# EAGLE design untitled (EAGLE 7.5.0)
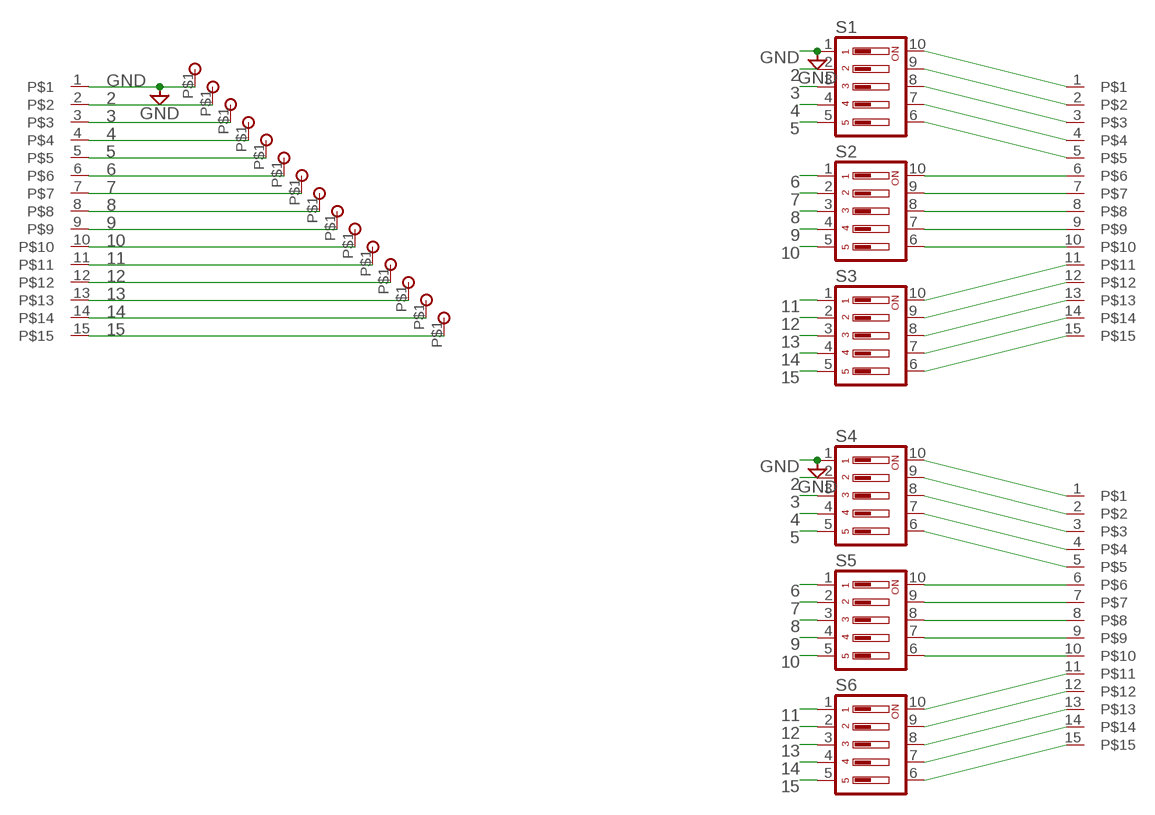
[diagram p0: schematic, sheet 1]

## Parts
C1  FMZ15  [FMZ15]
C2  FMZ15  [FMZ15]
RAS  FMZ15  [FMZ15]
S1  DIP05YL  [DIP05YL]
S2  DIP05YL  [DIP05YL]
S3  DIP05YL  [DIP05YL]
S4  DIP05YL  [DIP05YL]
S5  DIP05YL  [DIP05YL]
S6  DIP05YL  [DIP05YL]
U$4  CHECK_0.8MM  [CHECK_0.8MM]
U$5  CHECK_0.8MM  [CHECK_0.8MM]
U$6  CHECK_0.8MM  [CHECK_0.8MM]
U$7  CHECK_0.8MM  [CHECK_0.8MM]
U$8  CHECK_0.8MM  [CHECK_0.8MM]
U$9  CHECK_0.8MM  [CHECK_0.8MM]
U$10  CHECK_0.8MM  [CHECK_0.8MM]
U$11  CHECK_0.8MM  [CHECK_0.8MM]
U$12  CHECK_0.8MM  [CHECK_0.8MM]
U$13  CHECK_0.8MM  [CHECK_0.8MM]
U$14  CHECK_0.8MM  [CHECK_0.8MM]
U$15  CHECK_0.8MM  [CHECK_0.8MM]
U$16  CHECK_0.8MM  [CHECK_0.8MM]
U$17  CHECK_0.8MM  [CHECK_0.8MM]
U$18  CHECK_0.8MM  [CHECK_0.8MM]

## Nets
2: RAS.2 S1.2 S4.2 U$5.P$1
3: RAS.3 S1.3 S4.3 U$6.P$1
4: RAS.4 S1.4 S4.4 U$7.P$1
5: RAS.5 S1.5 S4.5 U$8.P$1
6: RAS.6 S2.1 S5.1 U$9.P$1
7: RAS.7 S2.2 S5.2 U$10.P$1
8: RAS.8 S2.3 S5.3 U$11.P$1
9: RAS.9 S2.4 S5.4 U$12.P$1
10: RAS.10 S2.5 S5.5 U$13.P$1
11: RAS.11 S3.1 S6.1 U$14.P$1
12: RAS.12 S3.2 S6.2 U$15.P$1
13: RAS.13 S3.3 S6.3 U$16.P$1
14: RAS.14 S3.4 S6.4 U$17.P$1
15: RAS.15 S3.5 S6.5 U$18.P$1
GND: RAS.1 S1.1 S4.1 U$4.P$1
N$6: C1.1 S1.10
N$7: C1.2 S1.9
N$8: C1.3 S1.8
N$9: C1.4 S1.7
N$10: C1.5 S1.6
N$16: C1.10 S2.6
N$17: C1.9 S2.7
N$18: C1.8 S2.8
N$19: C1.7 S2.9
N$20: C1.6 S2.10
N$26: C1.15 S3.6
N$27: C1.14 S3.7
N$28: C1.13 S3.8
N$29: C1.12 S3.9
N$30: C1.11 S3.10
N$31: C2.5 S4.6
N$32: C2.4 S4.7
N$33: C2.3 S4.8
N$34: C2.2 S4.9
N$35: C2.1 S4.10
N$36: C2.10 S5.6
N$37: C2.9 S5.7
N$38: C2.8 S5.8
N$39: C2.7 S5.9
N$40: C2.6 S5.10
N$41: C2.15 S6.6
N$42: C2.14 S6.7
N$43: C2.13 S6.8
N$44: C2.12 S6.9
N$45: C2.11 S6.10

## Library data of the parts
C1 C2 RAS = 08_CONECTOR:FMZ15
S1-S6 = 09_1_switch:DIP05YL: DIL/CODE SWITCH; OC_FARNELL: unknown; OC_NEWARK: unknown
U$4-U$18 = 08_CONECTOR:CHECK_0.8MM

## Board
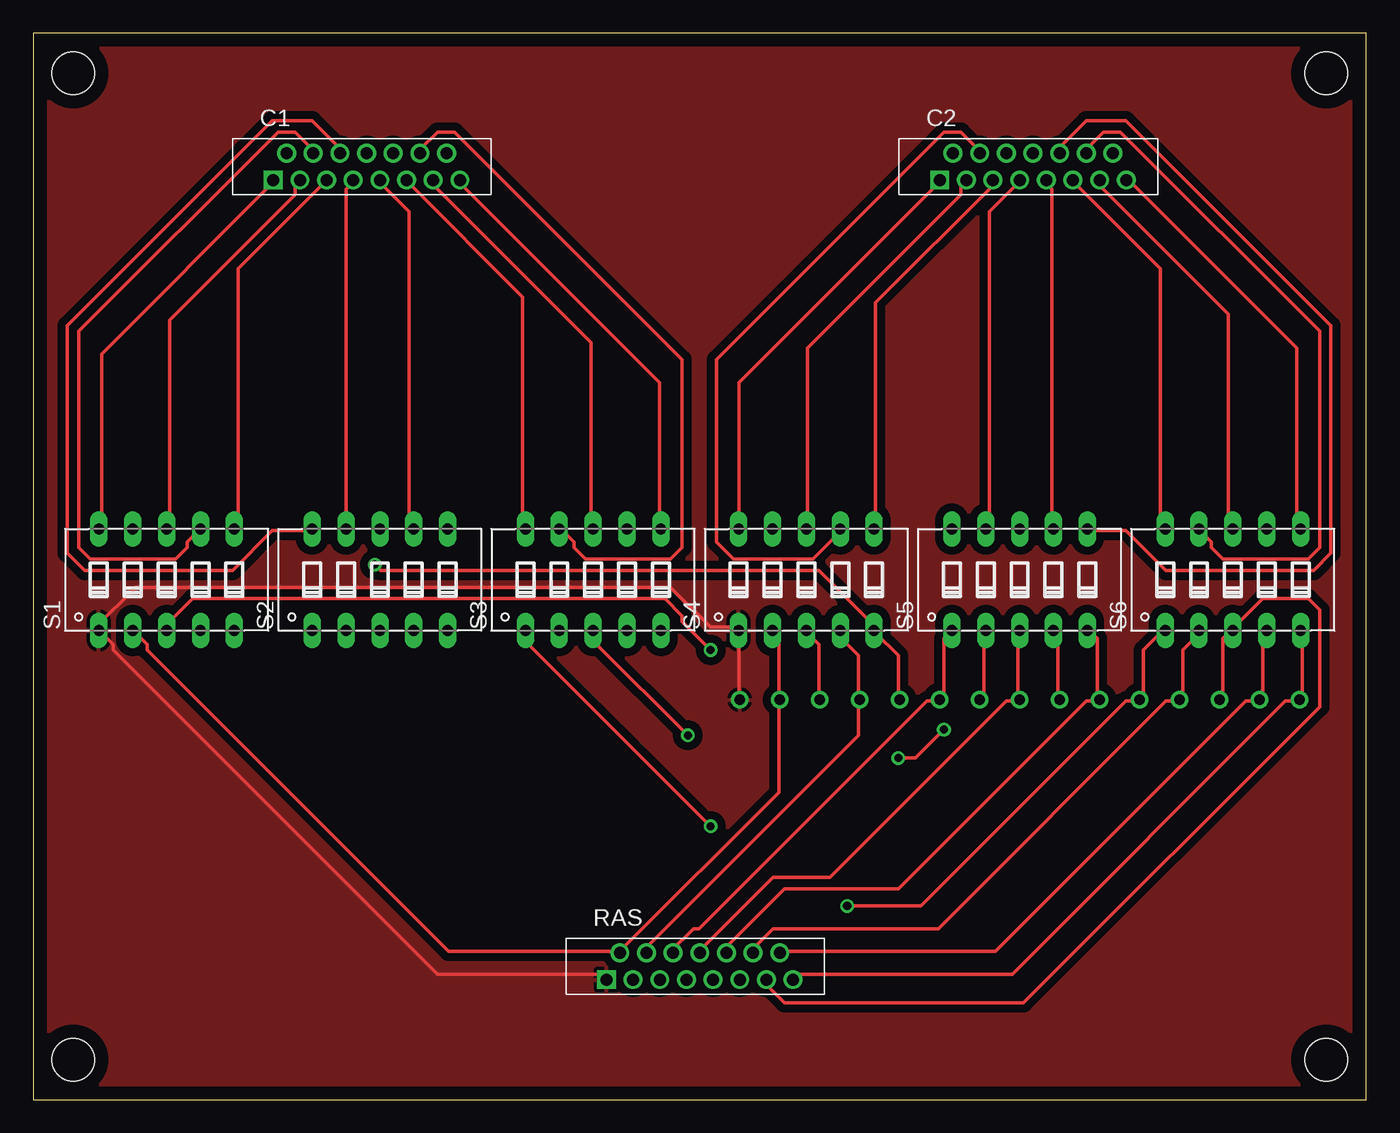
[diagram p1: board, top side]
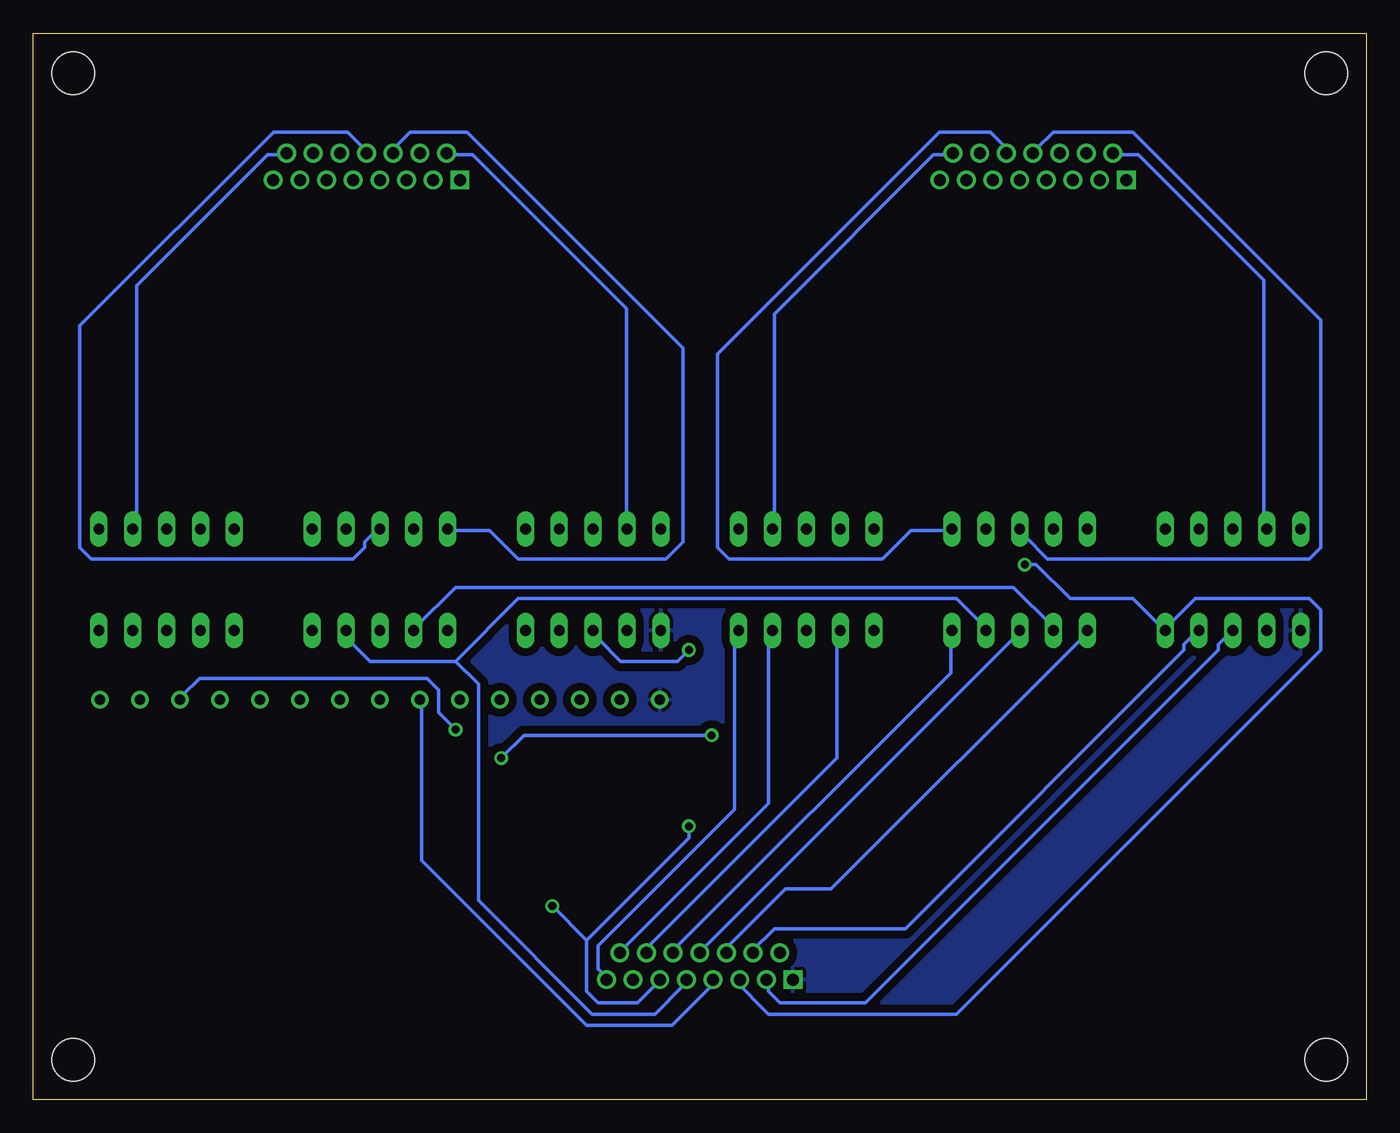
[diagram p2: board, bottom side, seen from below]

Size 100 x 80 mm. Coordinates in mm from the lower left corner, seen from the top.
Outline: 0,0 100,0 100,80 0,80 0,0
Copper layers (1*16): Top 0.035mm / dielectric 1.5mm / Bottom 0.035mm
Design rules "default *": minimum track width 10mil, minimum drill 24mil, track to track 0.6mm, track to pad 0.6mm, pad to pad 0.6mm, via to via 0.015240625mm, smd to smd 0.6mm, copper to edge 40mil, drill to drill 8mil, minimum pad ring 10mil, minimum via ring 8mil, stop-mask expansion 4mil, vias tented up to drill 0mil, thermal gap 10mil
Holes 3.2 mm at 3,77 97,77 97,3 3,3

### Footprints (pad centres in the part's own frame; a part is rotated, then mirrored left to right if it is on the bottom)
FMZ15 = drill 0.9 square: 1 -7,-1 | drill 0.9: 2 -6,1; 3 -5,-1; 4 -4,1; 5 -3,-1; 6 -2,1; 7 -1,-1; 8 0,1; 9 1,-1; 10 2,1; 11 3,-1; 12 4,1; 13 5,-1; 14 6,1; 15 7,-1
DIP05YL = drill 0.813 long: 1 -5.08,-3.81; 2 -2.54,-3.81; 3 0,-3.81; 4 2.54,-3.81; 5 5.08,-3.81; 6 5.08,3.81; 7 2.54,3.81; 8 0,3.81; 9 -2.54,3.81; 10 -5.08,3.81
CHECK_0.8MM = drill 0.8: P$1 0,0

### Placement (x,y rotation side)
C1  25,70 0 top
C2  75,70 0 top
RAS  50,10 0 top
S1  10,39 0 top
S2  26,39 0 top
S3  42,39 0 top
S4  58,39 0 top
S5  74,39 0 top
S6  90,39 0 top
U$4  53,30 90 top
U$5  56,30 90 top
U$6  59,30 90 top
U$7  62,30 90 top
U$8  65,30 90 top
U$9  68,30 90 top
U$10  71,30 90 top
U$11  74,30 90 top
U$12  77,30 90 top
U$13  80,30 90 top
U$14  83,30 90 top
U$15  86,30 90 top
U$16  89,30 90 top
U$17  92,30 90 top
U$18  95,30 90 top

### Tracks (layer width: path | path; a pad name or v marks a point on that pad's centre or on a via)
2
  Top 0.254: S4.2 55.51,35.01 55.94,34.59 55.94,30.32 U$5.P$1 55.94,29.89 55.94,23.06 43.98,11.1 | 43.98,11.1 31.17,11.1 8.54,33.73 8.54,34.16 7.69,35.01 S1.2 | 43.98,11.1 RAS.2
3  (via drill 0.61)
  Top 0.254: U$6.P$1 58.93,30.32 58.93,34.16 58.07,35.01 S4.3 | v50.81,33.73 48.68,35.87 48.68,36.3 47.4,37.58 11.96,37.58 9.82,35.44 S1.3
  Bottom 0.254: S1.3 10.25,35.01 11.1,34.16 11.1,33.73 37.58,7.26 43.98,7.26 44.84,8.11 44.84,8.97 RAS.3 | v50.81,33.73 51.67,32.88 55.94,32.88 57.65,34.59 57.65,35.01 S4.3
4
  Top 0.254: S4.4 60.21,35.01 61.91,33.31 61.91,30.32 U$7.P$1 61.91,29.89 61.91,27.33 45.69,11.1 RAS.4
  Bottom 0.254: S1.4 12.81,35.01 13.66,34.16 13.66,33.73 34.59,12.81 44.41,12.81 46.12,11.1 RAS.4
5  (via drill 0.61)
  Top 0.254: U$8.P$1 64.9,30.32 64.9,33.31 63.2,35.01 S4.5 62.77,35.44 62.77,35.87 58.93,39.71 26.05,39.71 v25.62,40.14
  Bottom 0.254: RAS.5 47.4,8.97 44.84,6.41 30.74,6.41 3.42,33.73 3.42,36.72 4.27,37.58 12.81,37.58 14.95,35.44 S1.5 15.37,35.44 17.51,37.58 22.2,37.58 24.77,40.14 v25.62,40.14
6
  Top 0.254: S5.1 68.75,35.01 68.32,34.59 68.32,30.32 U$9.P$1 67.89,29.89 67.04,29.89 49.96,12.81 49.53,12.81 47.82,11.1 RAS.6
  Bottom 0.254: S2.1 20.92,35.01 40.14,15.8 43.55,15.8 48.25,11.1 RAS.6
7
  Top 0.254: U$10.P$1 71.31,30.32 71.31,35.01 S5.2
  Bottom 0.254: S2.2 23.48,35.44 26.47,38.43 68.32,38.43 71.31,35.44 S5.2 | RAS.7 49.1,8.97 49.1,8.54 52.09,5.55 58.5,5.55 70.88,17.93 70.88,29.89 U$10.P$1
8
  Top 0.254: S5.3 73.87,35.01 73.87,30.32 U$11.P$1 73.87,29.89 73.02,29.89 59.78,16.65 55.51,16.65 49.96,11.1 RAS.8
  Bottom 0.254: S2.3 26.05,35.01 49.96,11.1 RAS.8
9
  Top 0.254: U$12.P$1 76.86,30.32 76.86,35.01 S5.4
  Bottom 0.254: 68.32,32.88 63.62,37.58 30.74,37.58 28.61,35.44 S2.4 | 68.32,32.88 74.72,32.88 76.86,35.01 S5.4 | 68.32,32.88 66.61,31.17 66.61,14.95 58.07,6.41 53.38,6.41 51.24,8.54 51.24,8.97 RAS.9
10
  Top 0.254: S5.5 79.42,35.01 79.85,34.59 79.85,30.32 U$13.P$1 79.85,29.89 79,29.89 64.9,15.8 56.36,15.8 51.67,11.1 RAS.10
  Bottom 0.254: S2.5 31.17,35.01 31.17,32.02 52.09,11.1 RAS.10
11  (via drill 0.61)
  Top 0.254: S6.1 84.55,35.01 83.27,33.73 83.27,30.32 U$14.P$1 82.84,29.89 81.98,29.89 66.61,14.52 v61.06,14.52 | v50.81,20.5 37.15,34.16 37.15,35.01 S3.1
  Bottom 0.254: v50.81,20.5 50.81,19.64 58.5,11.96 | 58.5,11.96 58.5,8.11 57.65,7.26 54.66,7.26 52.95,8.97 RAS.11 | 58.5,11.96 v61.06,14.52
12
  Top 0.254: S6.2 87.53,35.01 86.25,33.73 86.25,30.32 U$15.P$1 85.83,29.89 84.97,29.89 67.89,12.81 55.51,12.81 53.8,11.1 RAS.12
  Bottom 0.254: S3.2 39.71,35.01 39.71,25.62 54.23,11.1 RAS.12
13  (via drill 0.61)
  Top 0.254: U$16.P$1 89.24,30.32 89.24,34.59 89.67,35.01 S6.3 90.1,35.44 92.23,37.58 95.65,37.58 96.5,36.72 96.5,29.46 74.3,7.26 56.36,7.26 55.08,8.54 55.08,8.97 RAS.13 | v49.1,27.33 42.27,34.16 42.27,35.01 S3.3 | v64.9,25.62 66.19,25.62 v68.32,27.75
  Bottom 0.254: v49.1,27.33 63.2,27.33 v64.9,25.62 | v68.32,27.75 69.6,29.04 69.6,30.74 70.45,31.6 87.53,31.6 88.82,30.32 U$16.P$1
14
  Top 0.254: S6.4 92.23,35.01 92.23,30.32 U$17.P$1 91.81,29.89 90.95,29.89 72.16,11.1 56.36,11.1 RAS.14
  Bottom 0.254: S3.4 44.84,35.01 44.84,22.2 55.94,11.1 RAS.14
15
  Top 0.254: S6.5 95.22,35.01 95.22,30.32 U$18.P$1 94.79,29.89 93.94,29.89 73.44,9.39 57.22,9.39 RAS.15
  Bottom 0.254: S3.5 47.4,35.01 47.4,21.78 57.65,11.53 57.65,9.82 57.22,9.39 RAS.15
GND
  Top 0.254: U$4.P$1 52.95,30.32 52.95,35.01 S4.1 52.52,35.44 50.81,35.44 47.82,38.43 7.69,38.43 4.7,35.44 S1.1 5.12,35.01 5.98,34.16 5.98,33.73 30.32,9.39 42.7,9.39 RAS.1
  pour Top: 0,80 100,80 100,0 0,0
  pour Bottom: 0,80 100,80 100,0 0,0
N$6
  Top 0.254: S1.10 5.12,43.13 5.12,55.94 17.93,68.75 C1.1
N$7
  Bottom 0.254: S1.9 7.69,43.13 7.69,61.49 17.08,70.88 18.79,70.88 C1.2
N$8
  Top 0.254: S1.8 10.25,43.13 10.25,58.5 19.64,67.89 19.64,68.75 C1.3
N$9
  Top 0.254: S1.7 12.38,42.7 11.53,41.85 11.53,41.42 10.68,40.56 4.27,40.56 3.42,41.42 3.42,57.65 18.36,72.59 19.64,72.59 20.92,71.31 C1.4
N$10
  Top 0.254: S1.6 15.37,43.13 15.37,62.34 21.78,68.75 C1.5
N$16
  Bottom 0.254: S2.6 31.17,42.7 34.16,42.7 36.3,40.56 47.82,40.56 48.68,41.42 48.68,55.94 32.02,72.59 28.18,72.59 26.9,71.31 C1.10
N$17
  Top 0.254: S2.7 28.18,43.13 28.18,66.61 26.05,68.75 C1.9
N$18
  Bottom 0.254: S2.8 25.62,42.7 25.62,42.27 23.91,40.56 4.27,40.56 3.42,41.42 3.42,58.5 17.51,72.59 23.48,72.59 24.77,71.31 C1.8
N$19
  Top 0.254: S2.9 23.48,43.13 23.48,68.32 23.91,68.75 C1.7
N$20
  Top 0.254: S2.10 20.5,42.7 17.93,42.7 14.95,39.71 3.84,39.71 2.56,40.99 2.56,58.07 17.93,73.44 20.92,73.44 23.06,71.31 C1.6
N$26
  Top 0.254: S3.6 46.97,43.13 46.97,53.8 32.02,68.75 C1.15
N$27
  Bottom 0.254: S3.7 44.41,43.13 44.41,58.93 32.45,70.88 31.17,70.88 C1.14
N$28
  Top 0.254: S3.8 41.85,43.13 41.85,56.79 29.89,68.75 C1.13
N$29
  Top 0.254: S3.9 39.71,42.7 40.56,41.85 40.56,41.42 41.42,40.56 47.82,40.56 48.68,41.42 48.68,55.51 31.6,72.59 30.32,72.59 29.04,71.31 C1.12
N$30
  Top 0.254: S3.10 36.72,43.13 36.72,60.21 28.18,68.75 C1.11
N$31
  Top 0.254: S4.6 63.2,43.13 63.2,59.78 72.16,68.75 C2.5
N$32
  Top 0.254: S4.7 60.21,42.7 60.21,42.27 58.5,40.56 52.52,40.56 51.24,41.85 51.24,55.51 68.32,72.59 69.6,72.59 70.88,71.31 C2.4
N$33
  Top 0.254: S4.8 58.07,43.13 58.07,56.36 69.6,67.89 69.6,68.75 C2.3
N$34
  Bottom 0.254: S4.9 55.51,43.13 55.51,59.35 67.04,70.88 68.75,70.88 C2.2
N$35
  Top 0.254: S4.10 52.95,43.13 52.95,53.8 67.89,68.75 C2.1
N$36
  Top 0.254: S5.6 79.42,42.7 81.98,42.7 84.97,39.71 96.08,39.71 97.36,40.99 97.36,58.07 81.98,73.44 79,73.44 76.86,71.31 C2.10
N$37
  Top 0.254: S5.7 76.43,43.13 76.43,68.32 76.01,68.75 C2.9
N$38
  Bottom 0.254: S5.8 74.3,42.7 75.15,41.85 75.15,41.42 76.01,40.56 95.65,40.56 96.5,41.42 96.5,58.07 81.98,72.59 76.43,72.59 75.15,71.31 C2.8
N$39
  Top 0.254: S5.9 71.74,43.13 71.74,66.61 73.87,68.75 C2.7
N$40
  Bottom 0.254: S5.10 68.75,42.7 65.76,42.7 63.62,40.56 52.52,40.56 51.24,41.85 51.24,56.36 67.47,72.59 71.74,72.59 73.02,71.31 C2.6
N$41
  Top 0.254: S6.6 94.79,43.13 94.79,56.36 82.41,68.75 C2.15
N$42
  Bottom 0.254: S6.7 92.23,43.13 92.23,61.06 82.41,70.88 81.13,70.88 C2.14
N$43
  Top 0.254: S6.8 89.67,43.13 89.67,58.93 79.85,68.75 C2.13
N$44
  Top 0.254: S6.9 87.53,42.7 88.39,41.85 88.39,41.42 89.24,40.56 95.65,40.56 96.5,41.42 96.5,57.65 81.56,72.59 80.28,72.59 79,71.31 C2.12
N$45
  Top 0.254: S6.10 84.55,43.13 84.55,62.34 78.14,68.75 C2.11